# Altium schematic sheet 2015-10-09_12-53-271.schdoc
size 539 x 193 mm; SheetNumber: 1; SheetTotal: 1
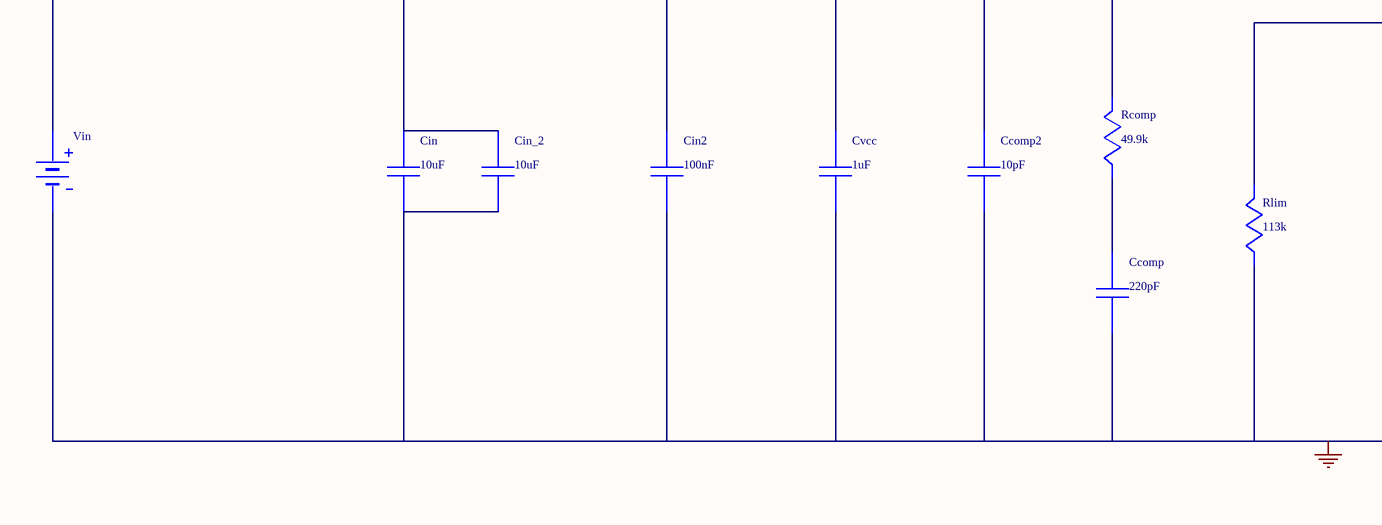
[diagram p0: 2015-10-09_12-53-271.schdoc, left]
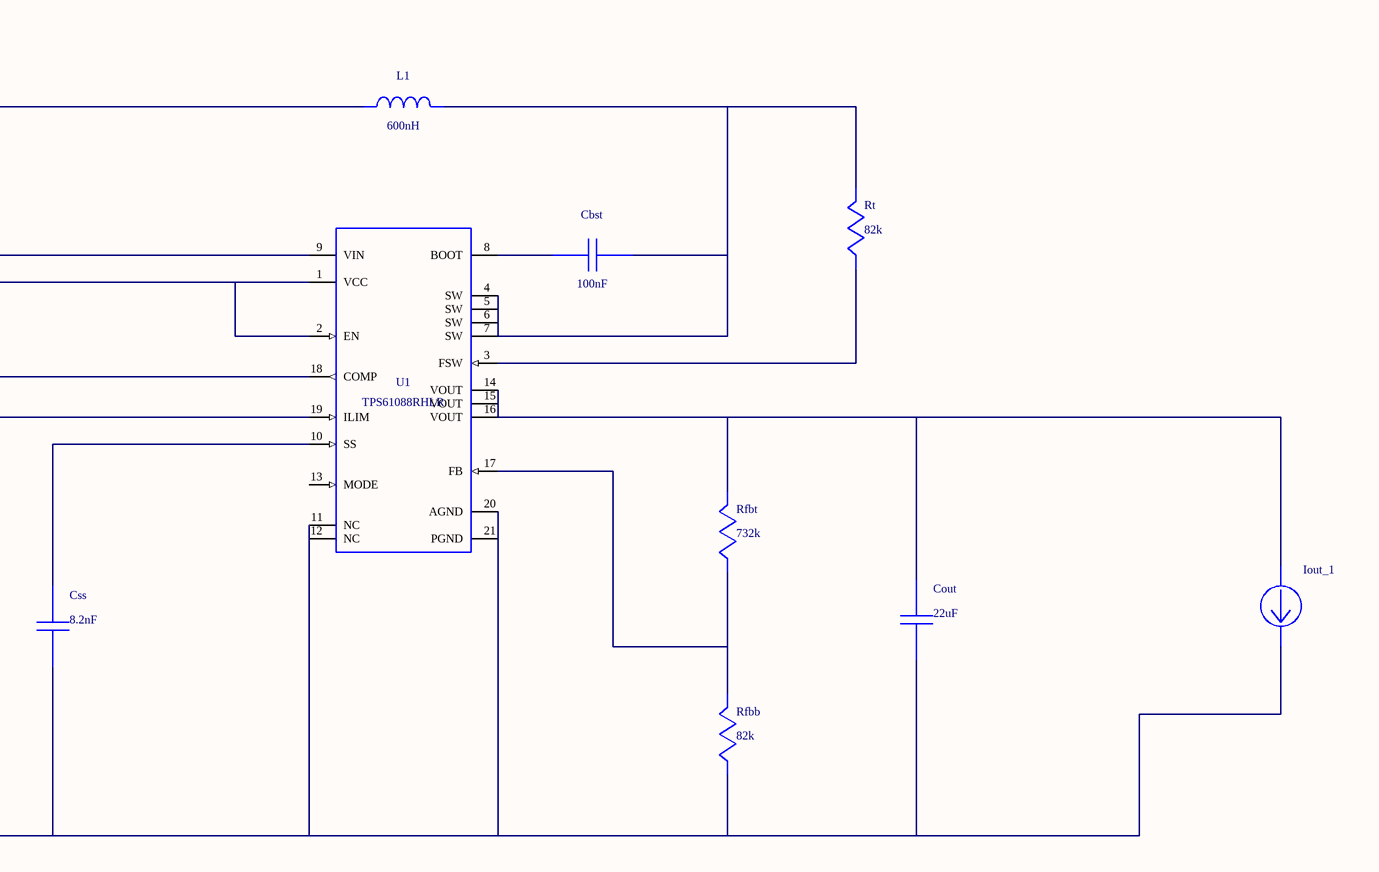
[diagram p1: 2015-10-09_12-53-271.schdoc, right]

## Parts
Cbst  value 100nF  (hidden comment: C1005X5R1A104K)
Ccomp  value 220pF  (hidden comment: 02013A220GAT2A)
Ccomp2  value 10pF  (hidden comment: CL02C100JO2ANNC)
Cin  value 10uF  (hidden comment: GRM188R61C106MA73D)
Cin2  value 100nF  (hidden comment: GRM155R61C104KA88D)
Cin_2  value 10uF  (hidden comment: GRM188R61C106MA73D)
Cout  value 22uF  (hidden comment: C3216X5R1E226M)
Css  value 8.2nF  (hidden comment: GRM155R71C822KA01D)
Cvcc  value 1uF  (hidden comment: C1608X5R1A105K)
Iout_1  WB_CURRENT_LOAD  (value not drawn)
L1  value 600nH  (hidden comment: XAL4020-601MEB)
Rcomp  value 49.9k  (hidden comment: CRCW040249K9FKED)
Rfbb  value 82k  (hidden comment: RC0603FR-0782KL)
Rfbt  value 732k  (hidden comment: CRCW0402732KFKED)
Rlim  value 113k  (hidden comment: ERJ-8ENF1133V)
Rt  value 82k  (hidden comment: RC1206FR-0782KL)
U1  TPS61088RHLR
Vin  WB_BATTERY  (value not drawn)

## Nets
0: Ccomp.2 Ccomp2.2 Cin.2 Cin2.2 Cin_2.2 Cout.2 Css.2 Cvcc.2 Iout_1.2(-) Rfbb.2 Rlim.2 U1.11(NC) U1.12(NC) U1.20(AGND) U1.21(PGND) Vin.2(-)
NetCbst_1: Cbst.1 U1.8(BOOT)
NetCbst_2: Cbst.2 L1.2 Rt.1 U1.4(SW) U1.5(SW) U1.6(SW) U1.7(SW)
NetCcomp2_1: Ccomp2.1 Rcomp.1 U1.18(COMP)
NetCcomp_1: Ccomp.1 Rcomp.2
NetCin_1: Cin.1 Cin2.1 Cin_2.1 L1.1 U1.9(VIN) Vin.1(+)
NetCout_1: Cout.1 Iout_1.1(+) Rfbt.1 U1.14(VOUT) U1.15(VOUT) U1.16(VOUT)
NetCss_1: Css.1 U1.10(SS)
NetCvcc_1: Cvcc.1 U1.1(VCC) U1.2(EN)
NetRfbb_1: Rfbb.1 Rfbt.2 U1.17(FB)
NetRlim_1: Rlim.1 U1.19(ILIM)
NetRt_2: Rt.2 U1.3(FSW)

Not connected (* = marked no-connect by the designer): U1 13(MODE)

## Library data of the parts
Cbst = C1005X5R1A104K: Manufacturer Name: TDK; PackageReference: C1005X5R1A104K; Manufacturer Part Number: C1005X5R1A104K
Ccomp = 02013A220GAT2A: Manufacturer Name: AVX; PackageReference: 02013A220GAT2A; Manufacturer Part Number: 02013A220GAT2A
Ccomp2 = CL02C100JO2ANNC: Manufacturer Name: Samsung Electro-Mechanics; PackageReference: CL02C100JO2ANNC; Manufacturer Part Number: CL02C100JO2ANNC
Cin Cin_2 = GRM188R61C106MA73D: GRM188R61C106MA7; Manufacturer Name: MuRata; PackageReference: GRM188R61C106MA73D; Manufacturer Part Number: GRM188R61C106MA73D
Cin2 = GRM155R61C104KA88D: GRM155R61C104KA8; Manufacturer Name: MuRata; PackageReference: GRM155R61C104KA88D; Manufacturer Part Number: GRM155R61C104KA88D
Cout = C3216X5R1E226M: Manufacturer Name: TDK; PackageReference: C3216X5R1E226M; Manufacturer Part Number: C3216X5R1E226M
Css = GRM155R71C822KA01D: GRM155R71C822KA0; Manufacturer Name: MuRata; PackageReference: GRM155R71C822KA01D; Manufacturer Part Number: GRM155R71C822KA01D
Cvcc = C1608X5R1A105K: Manufacturer Name: TDK; PackageReference: C1608X5R1A105K; Manufacturer Part Number: C1608X5R1A105K
Iout_1 = WB_CURRENT_LOAD: Value: UNLISTED; PackageReference: WB_CURRENT_LOAD; Manufacturer Part Number: WB_CURRENT_LOAD; Manufacturer Name: WB_CURRENT_LOAD
L1 = XAL4020-601MEB: Manufacturer Name: Coilcraft; PackageReference: XAL4020-601MEB; Manufacturer Part Number: XAL4020-601MEB
Rcomp = CRCW040249K9FKED: Manufacturer Name: Vishay-Dale; PackageReference: CRCW040249K9FKED; Manufacturer Part Number: CRCW040249K9FKED
Rfbb = RC0603FR-0782KL: Manufacturer Name: Yageo America; PackageReference: RC0603FR-0782KL; Manufacturer Part Number: RC0603FR-0782KL
Rfbt = CRCW0402732KFKED: Manufacturer Name: Vishay-Dale; PackageReference: CRCW0402732KFKED; Manufacturer Part Number: CRCW0402732KFKED
Rlim = ERJ-8ENF1133V: Manufacturer Name: Panasonic; PackageReference: ERJ-8ENF1133V; Manufacturer Part Number: ERJ-8ENF1133V
Rt = RC1206FR-0782KL: Manufacturer Name: Yageo America; PackageReference: RC1206FR-0782KL; Manufacturer Part Number: RC1206FR-0782KL
U1 = TPS61088RHLR: Manufacturer Name: Texas Instruments; Value: UNLISTED; PackageReference: TPS61088RHLR; Manufacturer Part Number: TPS61088RHLR
Vin = WB_BATTERY: Value: UNLISTED; PackageReference: WB_BATTERY; Manufacturer Part Number: WB_BATTERY; Manufacturer Name: WB_BATTERY